# EAGLE design Layout_Weather_Station_VX (EAGLE 9.6.2)
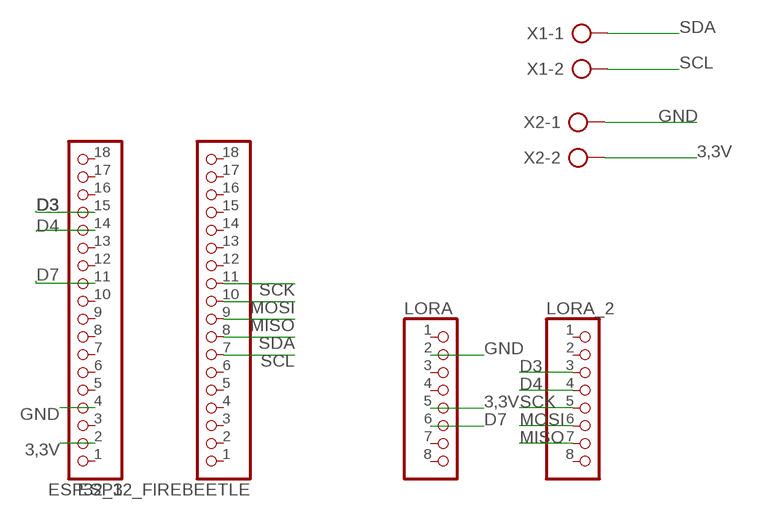
[diagram p0: schematic, sheet 1]

## Parts
ESP32_1  PINHD-1X18  [1X18]
ESP32_FIREBEETLE  PINHD-1X18  [1X18]
LORA  PINHD-1X8  [1X08]
LORA_2  PINHD-1X8  [1X08]
X1  AK300/2  [AK300/2]
X2  AK300/2  [AK300/2]

## Nets
3,3V: ESP32_1.2 LORA.5 X2.2
D3: ESP32_1.15 LORA_2.3
D4: ESP32_1.14 LORA_2.4
D7: ESP32_1.11 LORA.6
GND: ESP32_1.4 LORA.2 X2.1
MISO: ESP32_FIREBEETLE.9 LORA_2.7
MOSI: ESP32_FIREBEETLE.10 LORA_2.6
SCK: ESP32_FIREBEETLE.11 LORA_2.5
SCL: ESP32_FIREBEETLE.7 X1.2
SDA: ESP32_FIREBEETLE.8 X1.1
Unconnected: ESP32_1.1 ESP32_1.3 ESP32_1.5 ESP32_1.6 ESP32_1.7 ESP32_1.8 ESP32_1.9 ESP32_1.10 ESP32_1.12 ESP32_1.13 ESP32_1.16 ESP32_1.17 ESP32_1.18 ESP32_FIREBEETLE.1 ESP32_FIREBEETLE.2 ESP32_FIREBEETLE.3 ESP32_FIREBEETLE.4 ESP32_FIREBEETLE.5 ESP32_FIREBEETLE.6 ESP32_FIREBEETLE.12 ESP32_FIREBEETLE.13 ESP32_FIREBEETLE.14 ESP32_FIREBEETLE.15 ESP32_FIREBEETLE.16 ESP32_FIREBEETLE.17 ESP32_FIREBEETLE.18 LORA.1 LORA.3 LORA.4 LORA.7 LORA.8 LORA_2.1 LORA_2.2 LORA_2.8

## Library data of the parts
ESP32_1 ESP32_FIREBEETLE = pinhead:PINHD-1X18: PIN HEADER
LORA LORA_2 = pinhead:PINHD-1X8: PIN HEADER
X1 X2 = con-ptr500:AK300/2: CONNECTOR; OC_FARNELL: unknown; OC_NEWARK: unknown

## Net classes
0 default: width 0.305 mm, drill 0.508 mm, clearance 0.254 mm

## Board
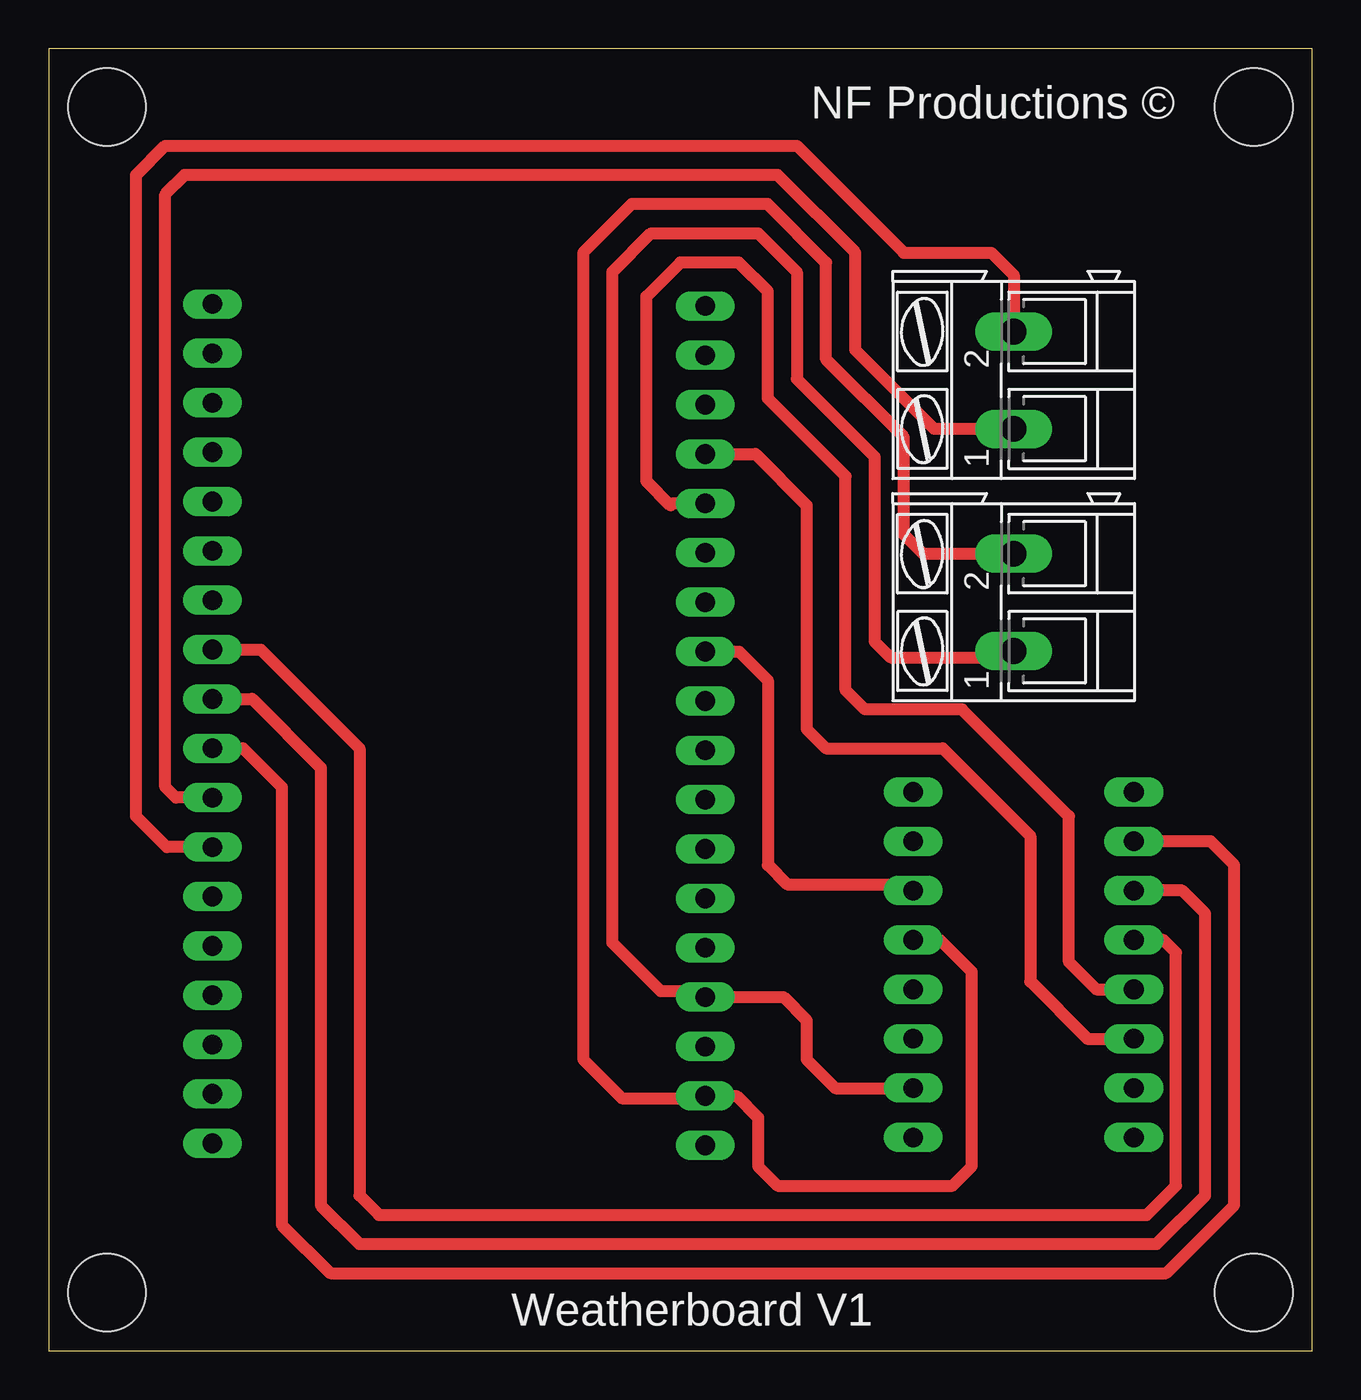
[diagram p1: board, top side]
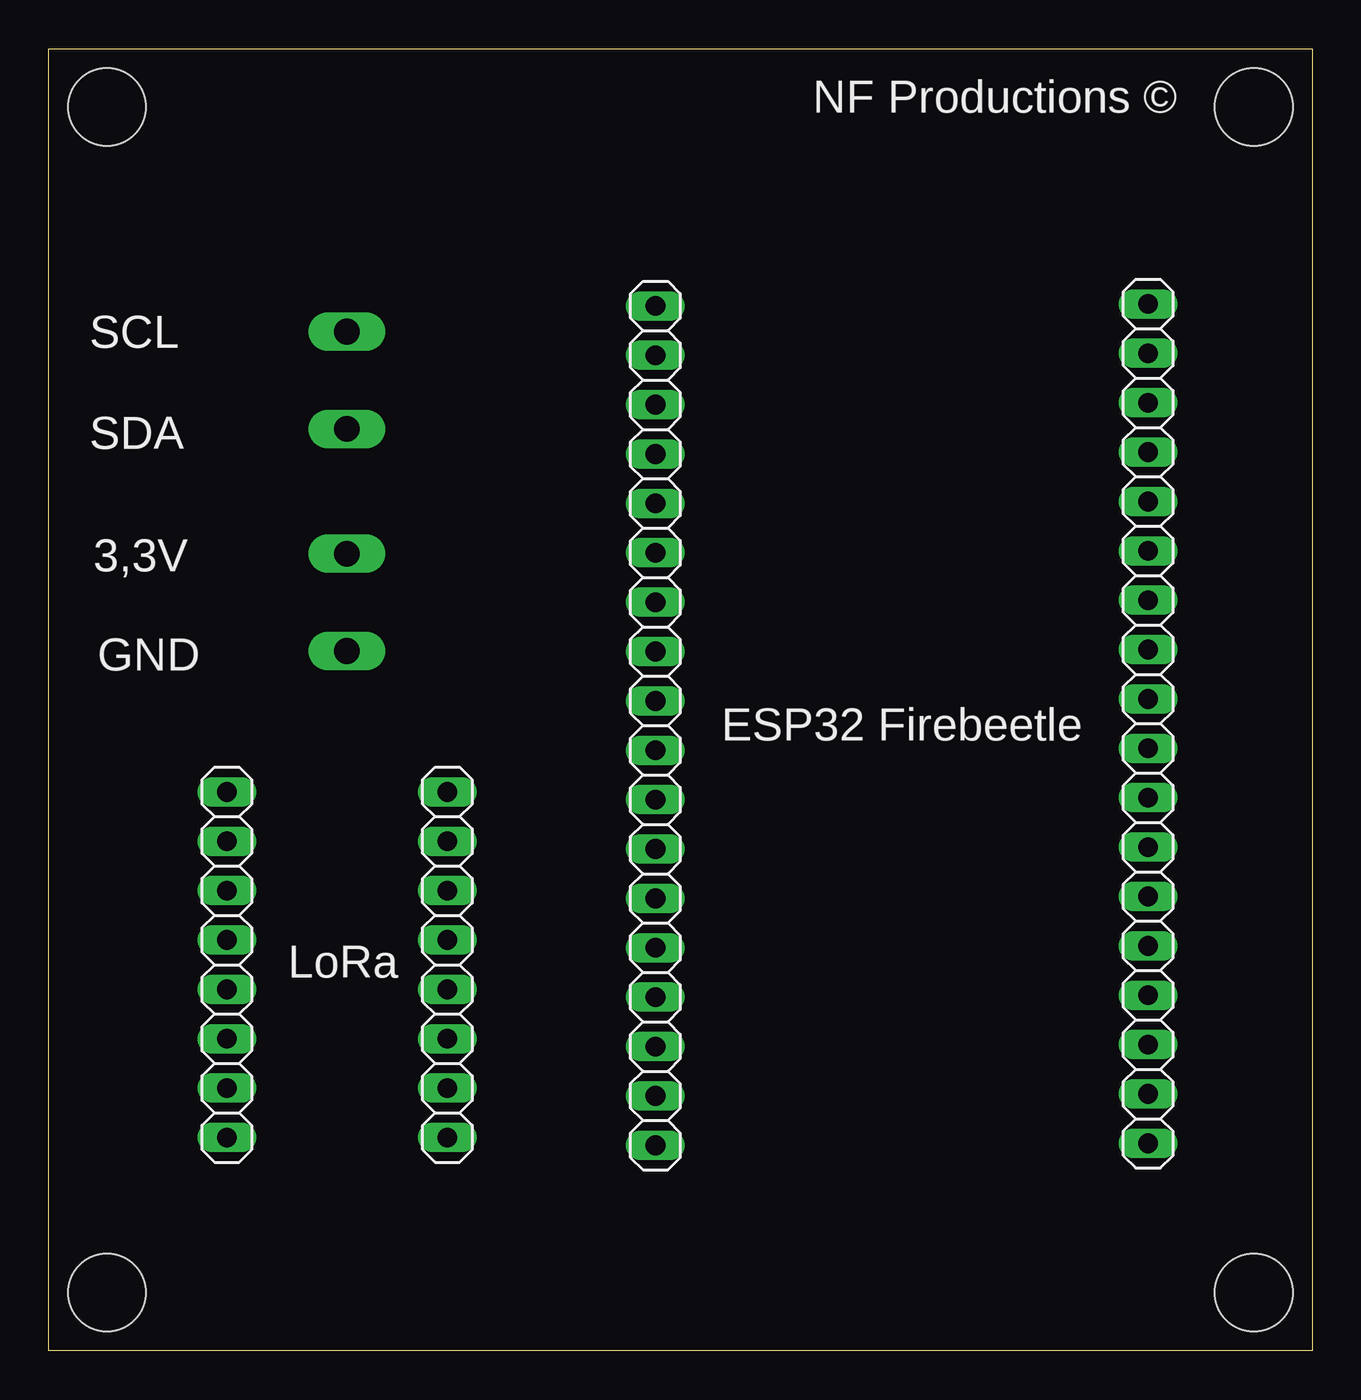
[diagram p2: board, bottom side, seen from below]

Size 65 x 67 mm. Coordinates in mm from the lower left corner, seen from the top.
Outline: 0,0 65,0 65,67 0,67 0,0
Copper layers (1*16): Top 0.035mm / dielectric 1.5mm / Bottom 0.035mm
Design rules "default": minimum track width 6mil, minimum drill 0.35mm, track to track 6mil, track to pad 6mil, pad to pad 6mil, via to via 6mil, smd to smd 6mil, copper to edge 40mil, drill to drill 6mil, minimum pad ring 10mil, minimum via ring 8mil, stop-mask expansion 4mil, vias tented up to drill 0mil, thermal gap 10mil
Holes 4 mm at 3,64 62,3 62,64 3,3

### Footprints (pad centres in the part's own frame; a part is rotated, then mirrored left to right if it is on the bottom)
1X18 = drill 1.016 long: 1 -21.59,0; 2 -19.05,0; 3 -16.51,0; 4 -13.97,0; 5 -11.43,0; 6 -8.89,0; 7 -6.35,0; 8 -3.81,0; 9 -1.27,0; 10 1.27,0; 11 3.81,0; 12 6.35,0; 13 8.89,0; 14 11.43,0; 15 13.97,0; 16 16.51,0; 17 19.05,0; 18 21.59,0
1X08 = drill 1.016 long: 1 -8.89,0; 2 -6.35,0; 3 -3.81,0; 4 -1.27,0; 5 1.27,0; 6 3.81,0; 7 6.35,0; 8 8.89,0
AK300/2 = drill 1.321 long: 1 -2.515,0; 2 2.489,0

### Placement (x,y rotation side)
ESP32_1  33.78,32.17 90 bottom
ESP32_FIREBEETLE  8.43,32.27 90 bottom
LORA  44.48,19.87 90 bottom
LORA_2  55.83,19.87 90 bottom
X1  49.65,49.95 90 top
X2  49.65,38.52 90 top

### Tracks (layer width: path | path; a pad name or v marks a point on that pad's centre or on a via)
3,3V
  Top 0.61: LORA.5 45.86,21.14 47.5,19.5 47.5,9.5 46.5,8.5 37.5,8.5 36.5,9.5 36.5,12 35.38,13.12 ESP32_1.2 33.66,13 29.5,13 27.5,15 27.5,56.5 30,59 37,59 40,56 40,51 44,47 44,42 45,41 X2.2
D3
  Top 0.61: LORA_2.3 53.44,16.06 50.5,19 50.5,26.5 46,31 40,31 39,32 39,43.5 36.36,46.14 ESP32_1.15
D4
  Top 0.61: ESP32_1.14 32.1,43.6 32,43.5 30.75,44.75 30.75,54.25 32.5,56 35.5,56 37,54.5 37,49 41,45 41,34 42,33 47,33 52.5,27.5 52.5,20 53.9,18.6 LORA_2.4
D7
  Top 0.61: ESP32_1.11 35.52,35.98 37,34.5 37,25 38,24 44.16,24 LORA.6
GND
  Top 0.61: LORA.2 40.48,13.52 39,15 39,17 37.8,18.2 ESP32_1.4 33.48,18.5 31.5,18.5 29,21 29,55.5 31,57.5 36.5,57.5 38.5,55.5 38.5,50 42.5,46 42.5,36.5 43.32,35.68 49.32,35.68 | 49.15,35.5 49.32,35.68 | 49.32,35.68 X2.1
MISO
  Top 0.61: ESP32_FIREBEETLE.9 10,31 12,29 12,6.5 14.5,4 57.5,4 61,7.5 61,25 59.78,26.22 LORA_2.7
MOSI
  Top 0.61: ESP32_FIREBEETLE.10 10.46,33.54 14,30 14,7.5 16,5.5 57,5.5 59.5,8 59.5,22.5 58.32,23.68 LORA_2.6
SCK
  Top 0.61: ESP32_FIREBEETLE.11 10.92,36.08 16,31 16,8 17,7 56.5,7 58,8.5 58,20.5 57.36,21.14 LORA_2.5
SCL
  Top 0.61: ESP32_FIREBEETLE.7 6.08,25.92 4.5,27.5 4.5,60.5 6,62 38.5,62 44,56.5 48.5,56.5 49.65,55.35 X1.2
SDA
  Top 0.61: ESP32_FIREBEETLE.8 6.54,28.46 6,29 6,59.5 7,60.5 37.5,60.5 41.5,56.5 41.5,51.5 45.56,47.44 X1.1

### Text on the board
tNames: NF Productions © | Weatherboard V1
bNames: NF Productions © | SCL | SDA | 3,3V | GND | ESP32 Firebeetle | LoRa